# Altium schematic sheet 4_downstream_power.SchDoc
size A
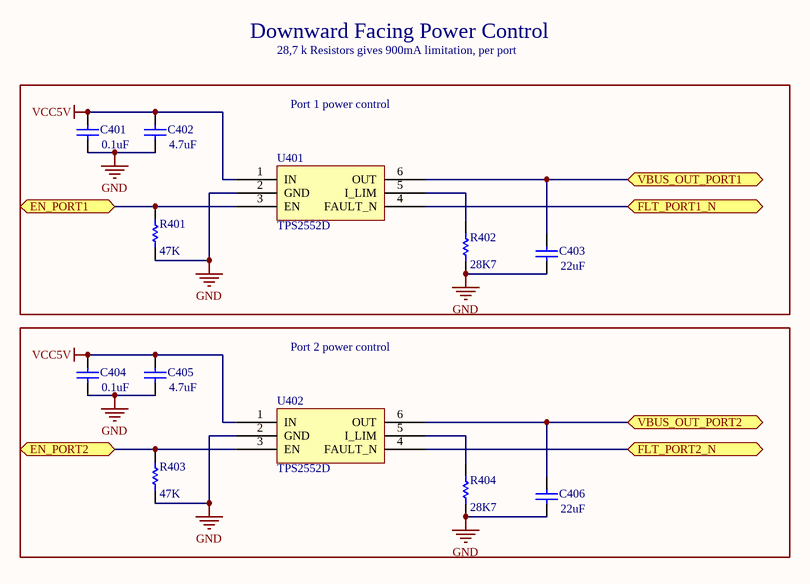
[diagram p0: 4_downstream_power.SchDoc]

## Parts
C401  value 0.1uF  [C0603[1608]]
C402  value 4.7uF  [C1206[3216]]
C403  value 22uF  [C1206[3216]]
C404  value 0.1uF  [C0603[1608]]
C405  value 4.7uF  [C1206[3216]]
C406  value 22uF  [C1206[3216]]
R401  value 47K  [R0603[1608]]
R402  value 28K7  [R0603[1608]]
R403  value 47K  [R0603[1608]]
R404  value 28K7  [R0603[1608]]
U401  TPS2552D  [SOT-23-6]
U402  TPS2552D  [SOT-23-6]

## Blocks framed on the sheet
Port 1 power control: C401-C403 R401 R402 U401
Port 2 power control: C404-C406 R403 R404 U402

## Ports
EN_PORT1, EN_PORT2, FLT_PORT1_N, FLT_PORT2_N, VBUS_OUT_PORT1, VBUS_OUT_PORT2

## Nets
GND: C401.1 C402.1 C403.1 C404.1 C405.1 C406.1 R401.2 R402.2 R403.2 R404.2 U401.2(GND) U402.2(GND)
VCC5V: C401.2 C402.2 C404.2 C405.2 U401.1(IN) U402.1(IN)
EN_PORT1: R401.1 U401.3(EN) ; port EN_PORT1
EN_PORT2: R403.1 U402.3(EN) ; port EN_PORT2
FLT_PORT1_N: U401.4(FAULT_N) ; port FLT_PORT1_N
FLT_PORT2_N: U402.4(FAULT_N) ; port FLT_PORT2_N
VBUS_OUT_PORT1: C403.2 U401.6(OUT) ; port VBUS_OUT_PORT1
VBUS_OUT_PORT2: C406.2 U402.6(OUT) ; port VBUS_OUT_PORT2
NetR402_1: R402.1 U401.5(I_LIM)
NetR404_1: R404.1 U402.5(I_LIM)

## Notes on the sheet
- Downward Facing Power Control
- 28,7 k Resistors gives 900mA limitation, per port

## Library data of the parts
C401 C404 = Cap: Capacitor; MFG: KEMET; MFGPN: C0603C104M5RACTU; Version: 0603 imperial
C402 C405 = Cap: Capacitor; MFG: KEMET; MFGPN: C1206C475K4PACTU; Version: 1206 imperial
C403 C406 = Cap: Capacitor; MFG: KEMET; MFGPN: C1206C226M8RACTU; Version: 1206 imperial
R401 R403 = Res1: Resistor; MFG: Vishay Dale; MFGPN: RCA060347K0FKEA; Version: 0603 imperial
R402 R404 = Res1: Resistor; MFG: Vishay Dale; MFGPN: CRCW060328K7FKEA; Version: 0603 imperial
U401 U402 = TPS2552D: MFG: Texas Instruments; MFGPN: TPS2552DBVR